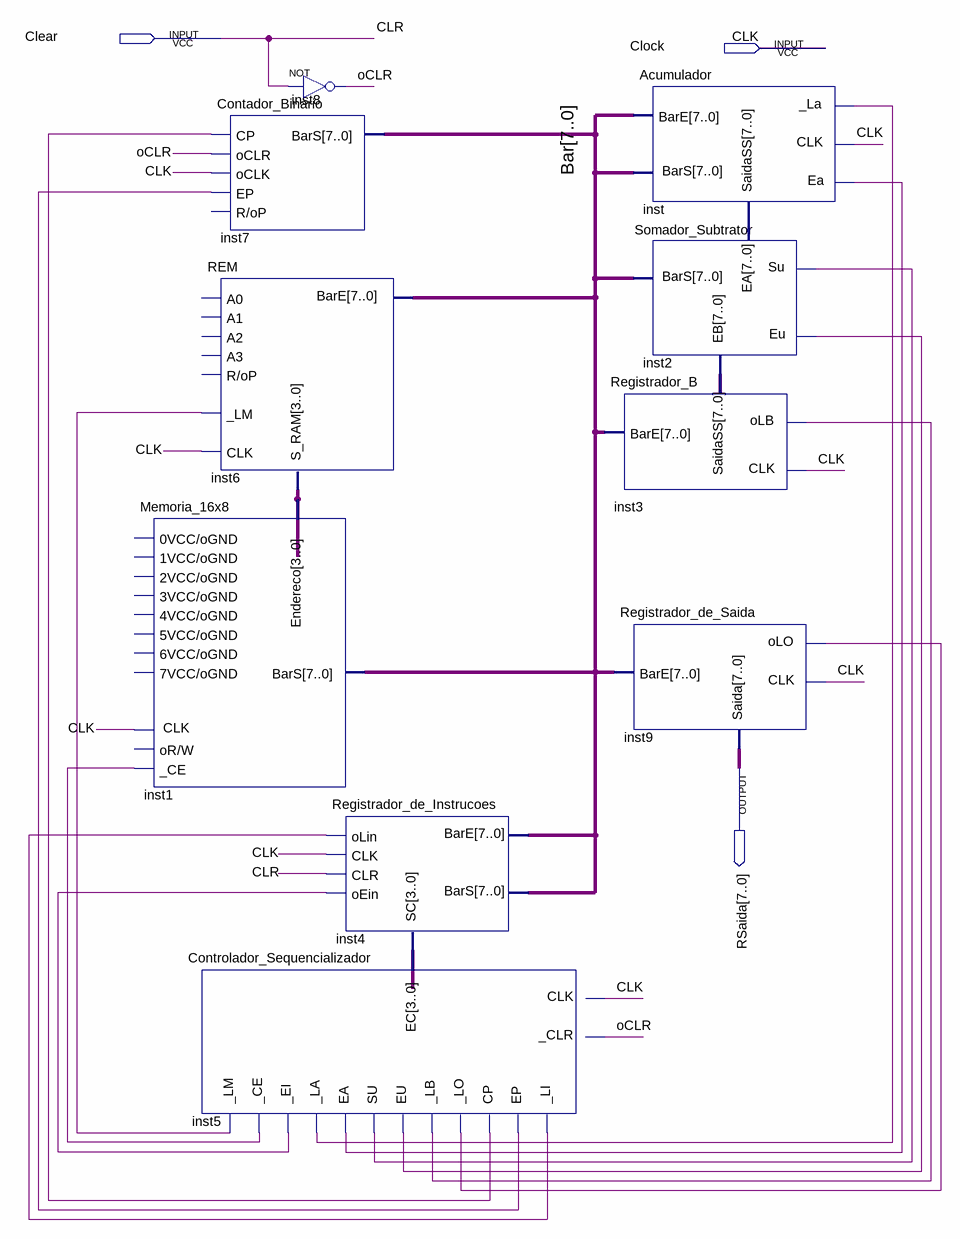
[diagram p0: schematic sheet]
// Quartus schematic Microcomputador.bdf as structural Verilog: 10 symbols, 3 pins
module Microcomputador (
  input  Clear,
  input  Clock,
  output [7:0] RSaida
);

  wire inst5__ce, inst5__ei, inst5__la, inst5__lb, inst5__li, inst5__lm, inst5__lo, inst5_cp, inst5_ea,
       inst5_ep, inst5_eu, inst5_su, oCLR;
  wire [3:0] inst4_sc, inst6_s_ram;
  wire [7:0] Bar, inst3_saidass, inst_saidass;

  Memoria_16x8 inst1 (
    ._CE(inst5__ce), .Endereco(inst6_s_ram), .CLK(Clock), .BarS(Bar));  // open: 0VCC/oGND, 1VCC/oGND, 2VCC/oGND, 3VCC/oGND, 4VCC/oGND, 5VCC/oGND, 6VCC/oGND, 7VCC/oGND, oR/W
  Contador_Binario inst7 (.CP(inst5_cp), .oCLR(oCLR), .oCLK(Clock), .EP(inst5_ep), .BarS(Bar));  // open: R/oP
  REM inst6 (.BarE(Bar), ._LM(inst5__lm), .CLK(Clock), .S_RAM(inst6_s_ram));  // open: A0, A1, A2, A3, R/oP
  Controlador_Sequencializador inst5 (
    ._CLR(oCLR), .EC(inst4_sc), .CLK(Clock), ._LM(inst5__lm), ._CE(inst5__ce), ._EI(inst5__ei),
    ._LA(inst5__la), .EA(inst5_ea), .SU(inst5_su), .EU(inst5_eu), ._LB(inst5__lb), ._LO(inst5__lo),
    .CP(inst5_cp), .EP(inst5_ep), ._LI(inst5__li));
  not inst8 (oCLR, Clear);
  Registrador_de_Instrucoes inst4 (
    .BarE(Bar), .oLin(inst5__li), .CLK(Clock), .CLR(Clear), .oEin(inst5__ei), .SC(inst4_sc), .BarS(Bar));
  Acumulador inst (.CLK(Clock), .Ea(inst5_ea), ._La(inst5__la), .BarE(Bar), .BarS(Bar), .SaidaSS(inst_saidass));
  Somador_Subtrator inst2 (.EA(inst_saidass), .EB(inst3_saidass), .Su(inst5_su), .Eu(inst5_eu), .BarS(Bar));
  Registrador_B inst3 (.BarE(Bar), .oLB(inst5__lb), .CLK(Clock), .SaidaSS(inst3_saidass));
  Registrador_de_Saida inst9 (.BarE(Bar), .oLO(inst5__lo), .CLK(Clock), .Saida(RSaida));

  // Other names for the same wires on the sheet: CLR = Clear; CLK = Clock
endmodule
